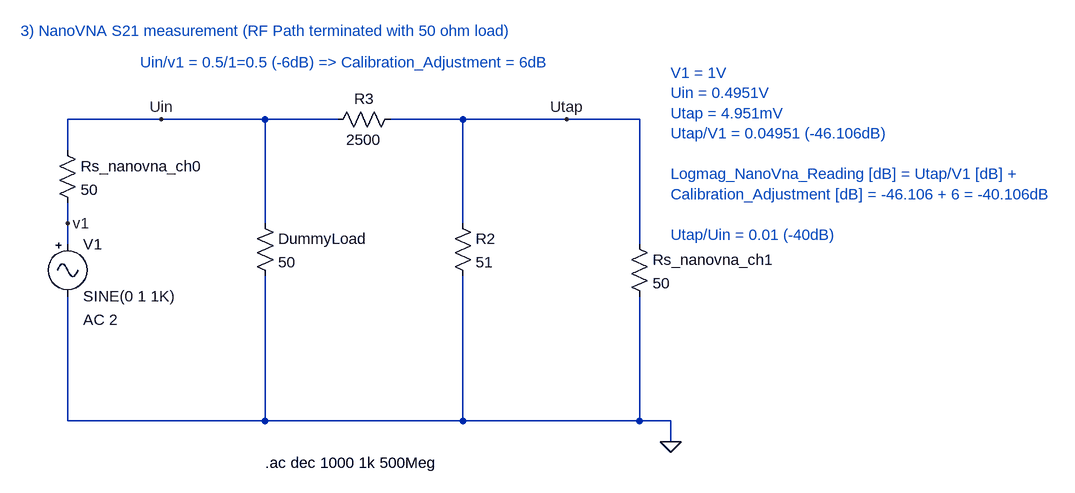
[diagram p0: schematic RFTap_v1_terminated_RF_Path.asc]
RFTap_v1_terminated_RF_Path.asc, the LTspice schematic file:
Version 4
SHEET 1 1764 1784
WIRE -3312 464 -3456 464
WIRE -3152 464 -3312 464
WIRE -3040 464 -3152 464
WIRE -2848 464 -2960 464
WIRE -2688 464 -2848 464
WIRE -2576 464 -2688 464
WIRE -3456 512 -3456 464
WIRE -3456 624 -3456 592
WIRE -3152 624 -3152 464
WIRE -2848 624 -2848 464
WIRE -3456 656 -3456 624
WIRE -2576 656 -2576 464
WIRE -3456 928 -3456 736
WIRE -3152 928 -3152 704
WIRE -3152 928 -3456 928
WIRE -2848 928 -2848 704
WIRE -2848 928 -3152 928
WIRE -2576 928 -2576 736
WIRE -2576 928 -2848 928
WIRE -2528 928 -2576 928
WIRE -2528 960 -2528 928
FLAG -2528 960 0
FLAG -3456 624 v1
FLAG -3312 464 Uin
FLAG -2688 464 Utap
SYMBOL Misc\\signal -3456 640 R0
WINDOW 123 24 132 Left 2
WINDOW 39 24 160 Left 2
SYMATTR Value2 AC 2
SYMATTR InstName V1
SYMBOL res -2592 640 R0
SYMATTR InstName Rs_nanovna_ch1
SYMATTR Value 50
SYMBOL res -3472 496 R0
SYMATTR InstName Rs_nanovna_ch0
SYMATTR Value 50
SYMBOL res -3168 608 R0
SYMATTR InstName DummyLoad
SYMATTR Value 50
SYMBOL res -2864 608 R0
SYMATTR InstName R2
SYMATTR Value 51
SYMBOL res -2944 448 R90
WINDOW 0 0 56 VBottom 2
WINDOW 3 32 56 VTop 2
SYMATTR InstName R3
SYMATTR Value 2500
TEXT -3152 992 Left 2 !.ac dec 1000 1k 500Meg
TEXT -3528 328 Left 2 ;3) NanoVNA S21 measurement (RF Path terminated with 50 ohm load)
TEXT -3344 376 Left 2 ;Uin/v1 = 0.5/1=0.5 (-6dB) => Calibration_Adjustment = 6dB
TEXT -2528 392 Left 2 ;V1 = 1V\nUin = 0.4951V\nUtap = 4.951mV\nUtap/V1 = 0.04951 (-46.106dB)\n \nLogmag_NanoVna_Reading [dB] = Utap/V1 [dB] + \nCalibration_Adjustment [dB] = -46.106 + 6 = -40.106dB\n \nUtap/Uin = 0.01 (-40dB)

The netlist it stands for:
* RFTap_v1_terminated_RF_Path.asc
V1 v1 0 SINE(0 1 1K) AC 2
Rs_nanovna_ch1 Utap 0 50
Rs_nanovna_ch0 Uin v1 50
R§DummyLoad Uin 0 50
R2 Utap 0 51
R3 Utap Uin 2500
.ac dec 1000 1k 500Meg
* 3) NanoVNA S21 measurement (RF Path terminated with 50 ohm load)
* Uin/v1 = 0.5/1=0.5 (-6dB) => Calibration_Adjustment = 6dB
* V1 = 1V
* Uin = 0.4951V
* Utap = 4.951mV
* Utap/V1 = 0.04951 (-46.106dB)
* Logmag_NanoVna_Reading [dB] = Utap/V1 [dB] +
* Calibration_Adjustment [dB] = -46.106 + 6 = -40.106dB
* Utap/Uin = 0.01 (-40dB)
.backanno
.end